# EAGLE design CAN (EAGLE 9.5.1)
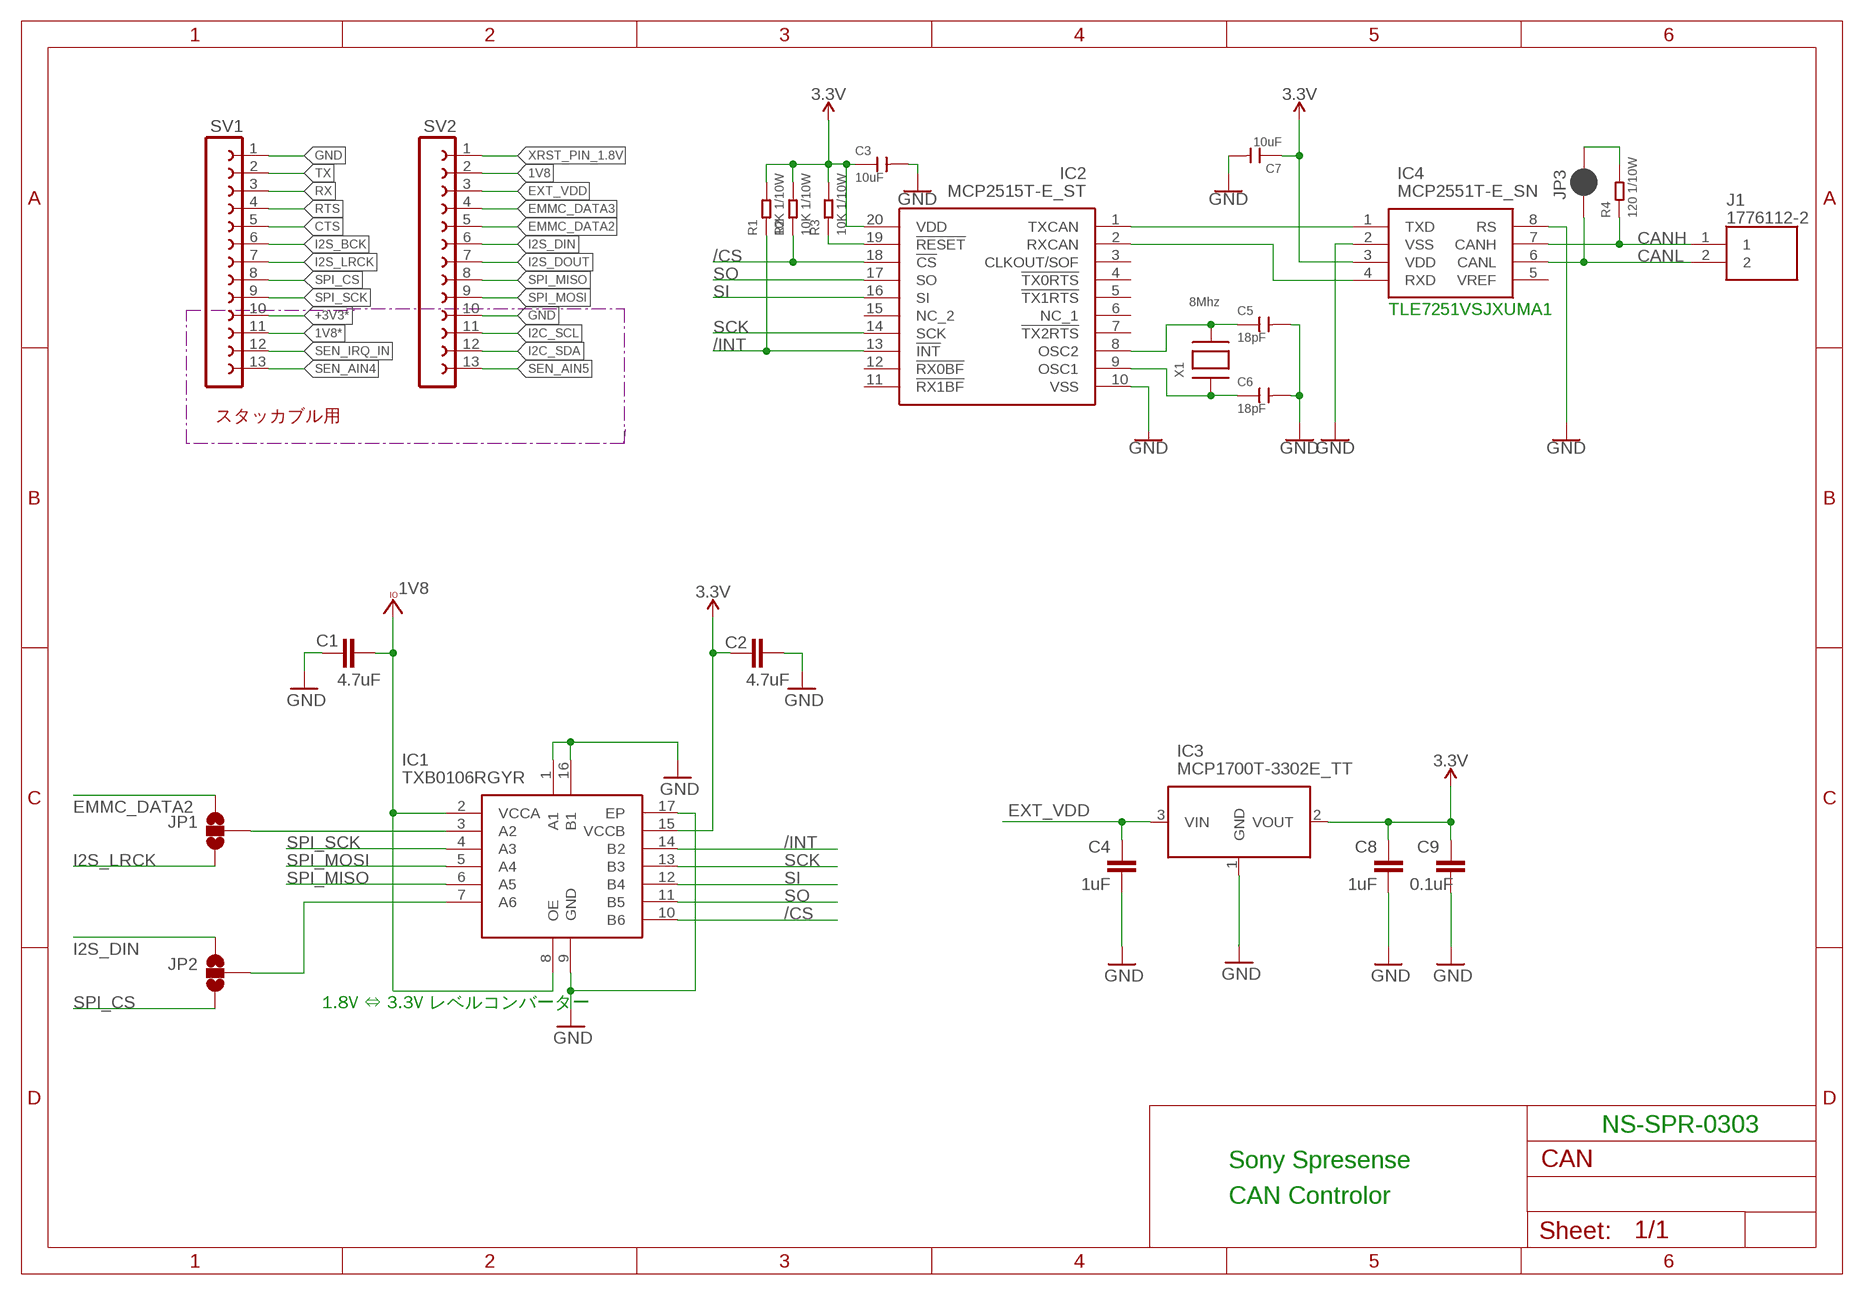
[diagram p0: schematic, sheet 1]

## Parts
C1  4.7uF  C-EUC0603K  [C0603K]
C2  4.7uF  C-EUC0603K  [C0603K]
C3  10uF  CERAMIC-27PF-50V-5%-NPO(0603)  [C0603]
C4  1uF  C-EUC0603K  [C0603K]
C5  18pF  CERAMIC-27PF-50V-5%-NPO(0603)  [C0603]
C6  18pF  CERAMIC-27PF-50V-5%-NPO(0603)  [C0603]
C7  10uF  CERAMIC-27PF-50V-5%-NPO(0603)  [C0603]
C8  1uF  C-EUC0603K  [C0603K]
C9  0.1uF  C-EUC0603K  [C0603K]
IC1  TXB0106RGYR  [SN74CBT3257CRGYR]
IC2  MCP2515T-E_ST  [SOP65P640X120-20N]
IC3  MCP1700T-3302E_TT  [SOT95P237X112-3N]
IC4  MCP2551T-E_SN  [SOIC127P600X175-8N]
J1  1776112-2  [SHDR2W90P0X348_1X2_700X730X850]
JP1  JUMPER-SMT_3_NO_NO-SILK  [SMT-JUMPER_3_NO_NO-SILK]
JP2  JUMPER-SMT_3_NO_NO-SILK  [SMT-JUMPER_3_NO_NO-SILK]
JP3  JUMPER-SMT_2_NC_PASTE_NO-SILK  [SMT-JUMPER_2_NC_PASTE_NO-SILK]
R1  10K 1/10W  SMD-RES-10K-5%-1/10W(0603)  [R0603]
R2  10K 1/10W  SMD-RES-10K-5%-1/10W(0603)  [R0603]
R3  10K 1/10W  SMD-RES-10K-5%-1/10W(0603)  [R0603]
R4  120 1/10W  SMD-RES-10K-5%-1/10W(0603)  [R0603]
SV1  FE13-1  [FE13]
SV2  FE13-1  [FE13]
X1  8Mhz  306010040_XTAL_12MHZ_HC49UP  [HC49UP]

## Nets
1V8: C1.2 IC1.2(VCCA) IC1.8(OE) SV2.2
1V8*: SV1.11
3.3V: C2.1 C3.1 C7.1 C8.1 C9.1 IC1.15(VCCB) IC2.20(VDD) IC3.2(VOUT) IC4.3(VDD) R1.2 R2.2 R3.2
+3V3*: SV1.10
/CS: IC1.10(B6) IC2.18(!CS) R2.1
/INT: IC1.14(B2) IC2.13(!INT) R1.1
CANH: IC4.7(CANH) J1.1 R4.1
CANL: IC4.6(CANL) J1.2 JP3.1
CTS: SV1.5
EMMC_DATA2: JP1.1 SV2.5
EMMC_DATA3: SV2.4
EXT_VDD: C4.1 IC3.3(VIN) SV2.3
GND: C1.1 C2.2 C3.2 C4.2 C5.2 C6.2 C7.2 C8.2 C9.2 IC1.1(A1) IC1.9(GND) IC1.16(B1) IC1.17(EP) IC2.10(VSS) IC3.1(GND) IC4.2(VSS) IC4.8(RS) SV1.1 SV2.10
I2C_SCL: SV2.11
I2C_SDA: SV2.12
I2S_BCK: SV1.6
I2S_DIN: JP2.1 SV2.6
I2S_DOUT: SV2.7
I2S_LRCK: JP1.3 SV1.7
N$1: IC2.1(TXCAN) IC4.1(TXD)
N$2: IC2.2(RXCAN) IC4.4(RXD)
N$3: IC1.7(A6) JP2.2
N$4: IC1.3(A2) JP1.2
N$5: C5.1 IC2.8(OSC2) X1.P$2
N$8: C6.1 IC2.9(OSC1) X1.P$1
N$9: JP3.2 R4.2
N$14: IC2.19(!RESET) R3.1
RTS: SV1.4
RX: SV1.3
SCK: IC1.13(B3) IC2.14(SCK)
SEN_AIN4: SV1.13
SEN_AIN5: SV2.13
SEN_IRQ_IN: SV1.12
SI: IC1.12(B4) IC2.16(SI)
SO: IC1.11(B5) IC2.17(SO)
SPI_CS: JP2.3 SV1.8
SPI_MISO: IC1.6(A5) SV2.8
SPI_MOSI: IC1.5(A4) SV2.9
SPI_SCK: IC1.4(A3) SV1.9
TX: SV1.2
XRST_PIN_1.8V: SV2.1
Unconnected: IC2.3(CLKOUT/SOF) IC2.4(!TX0RTS) IC2.5(!TX1RTS) IC2.6(NC_1) IC2.7(!TX2RTS) IC2.11(!RX1BF) IC2.12(!RX0BF) IC2.15(NC_2) IC4.5(VREF)

## Notes on the sheet
- TLE7251VSJXUMA1
- スタッカブル用
- 1.8V ⇔ 3.3V レベルコンバーター
- NS-SPR-0303
- Sony Spresense
- CAN Controlor

## Library data of the parts
C1 C2 C4 C8 C9 = rcl:C-EU: CAPACITOR, European symbol; SPICEPREFIX: C
C3 C5-C7 = Seeed-Capacitor:CERAMIC-27PF-50V-5%-NPO(0603): 302010142; MPN: CC0603JRNPO9BN270; VALUE: 27pf
IC1 = SamacSys_Parts:TXB0106RGYR: Translation - Voltage Levels 8B Bidirec Vltg-Lev Translator Source: Datasheet <https://www.ti.com/lit/gpn/TXB0106>; DESCRIPTION: Translation - Voltage Levels 8B Bidirec Vltg-Lev Translator; HEIGHT: mm; MANUFACTURER_NAME: Texas Instruments; MANUFACTURER_PART_NUMBER: TXB0106RGYR; MOUSER_PART_NUMBER: 595-TXB0106RGYR; MOUSER_PRICE-STOCK: https://www.mouser.co.uk/ProductDetail/Texas-Instruments/TXB0106RGYR?qs=XGzIaZb%2FFYLhB9Sk%252BZUXMA%3D%3D
IC2 = SamacSys_Parts:MCP2515T-E_ST: CAN Interface IC W/ SPI Inter 125dC Source: Datasheet <https://componentsearchengine.com/Datasheets/1/MCP2515T-E_ST.pdf>; DESCRIPTION: CAN Interface IC W/ SPI Inter 125dC; HEIGHT: 1.2mm; MANUFACTURER_NAME: Microchip; MANUFACTURER_PART_NUMBER: MCP2515T-E/ST; MOUSER_PART_NUMBER: 579-MCP2515T-E/ST; MOUSER_PRICE-STOCK: https://www.mouser.co.uk/ProductDetail/Microchip-Technology/MCP2515T-E-ST?qs=gZwDaUDMhIfK2YaexRiDHw%3D%3D
IC3 = SamacSys_Parts:MCP1700T-3302E_TT: LDO voltage regulator 250mA Isupply 1uA Source: Datasheet <https://componentsearchengine.com/Datasheets/1/MCP1700T-3302E_TT.pdf>; DESCRIPTION: LDO voltage regulator 250mA Isupply 1uA; HEIGHT: 1.12mm; MANUFACTURER_NAME: Microchip; MANUFACTURER_PART_NUMBER: MCP1700T-3302E/TT; MOUSER_PART_NUMBER: 579-MCP1700T3302E/TT; MOUSER_PRICE-STOCK: https://www.mouser.com/Search/Refine.aspx?Keyword=579-MCP1700T3302E%2FTT
IC4 = SamacSys_Parts:MCP2551T-E_SN: CAN Interface IC Hi Spd CAN Transceiv Source: Datasheet <https://componentsearchengine.com/Datasheets/1/MCP2551T-E_SN.pdf>; DESCRIPTION: CAN Interface IC Hi Spd CAN Transceiv; HEIGHT: 1.75mm; MANUFACTURER_NAME: Microchip; MANUFACTURER_PART_NUMBER: MCP2551T-E/SN; MOUSER_PART_NUMBER: 579-MCP2551T-E/SN; MOUSER_PRICE-STOCK: https://www.mouser.co.uk/ProductDetail/Microchip-Technology/MCP2551T-E-SN?qs=gZwDaUDMhIcQtLtB%252B7bOWQ%3D%3D
J1 = SamacSys_Parts:1776112-2: Conn Eurostyle Block 2 POS 3.5mm Solder ST Thru-Hole 12A/Contact Source: Datasheet <https://www.te.com/commerce/DocumentDelivery/DDEController?Action=showdoc&DocId=Customer Drawing1776112P1pdfEnglishENG_CD_1776112_P1.pdf1776112-2>; DESCRIPTION: Conn Eurostyle Block 2 POS 3.5mm Solder ST Thru-Hole 12A/Contact; HEIGHT: 8.5mm; MANUFACTURER_NAME: TE Connectivity; MANUFACTURER_PART_NUMBER: 1776112-2; MOUSER_PART_NUMBER: 571-1776112-2; MOUSER_PRICE-STOCK: https://www.mouser.co.uk/ProductDetail/TE-Connectivity/1776112-2?qs=wXhBCuSapIMFZRJKCceP3Q%3D%3D
JP1 JP2 = SparkFun-Jumpers:JUMPER-SMT_3_NO: Normally open jumper This jumper has three pads in close proximity to each other. Apply solder to close the connection(s).
JP3 = SparkFun-Jumpers:JUMPER-SMT_2_NC_PASTE: Normally closed solder jumper This jumper has an aperture in the stencil to allow solder paste to bridge the split in the wire so it's normally closed (NC). Wick off the solder to open the connection. Reapply solder to reclose the connection.
R1-R3 = OPL_Resistor:SMD-RES-10K-5%-1/10W(0603): 301010293; MPN: RC0603JR-0710KL
R4 = OPL_Resistor:SMD-RES-10K-5%-1/10W(0603): 301010293; MPN: RC0603JR-0710KL; VALUE: 10K 1/10W
SV1 SV2 = con-lsta:FE13-1: FEMALE HEADER; OC_FARNELL: unknown; OC_NEWARK: unknown
X1 = Seeed-OPL-2017-01-Crystal-Akita:306010040_XTAL_12MHZ_HC49UP: SMD Crystal 12Mhz-20pF-20ppm-40R;HC49UP, SKU: 306010040

## Board
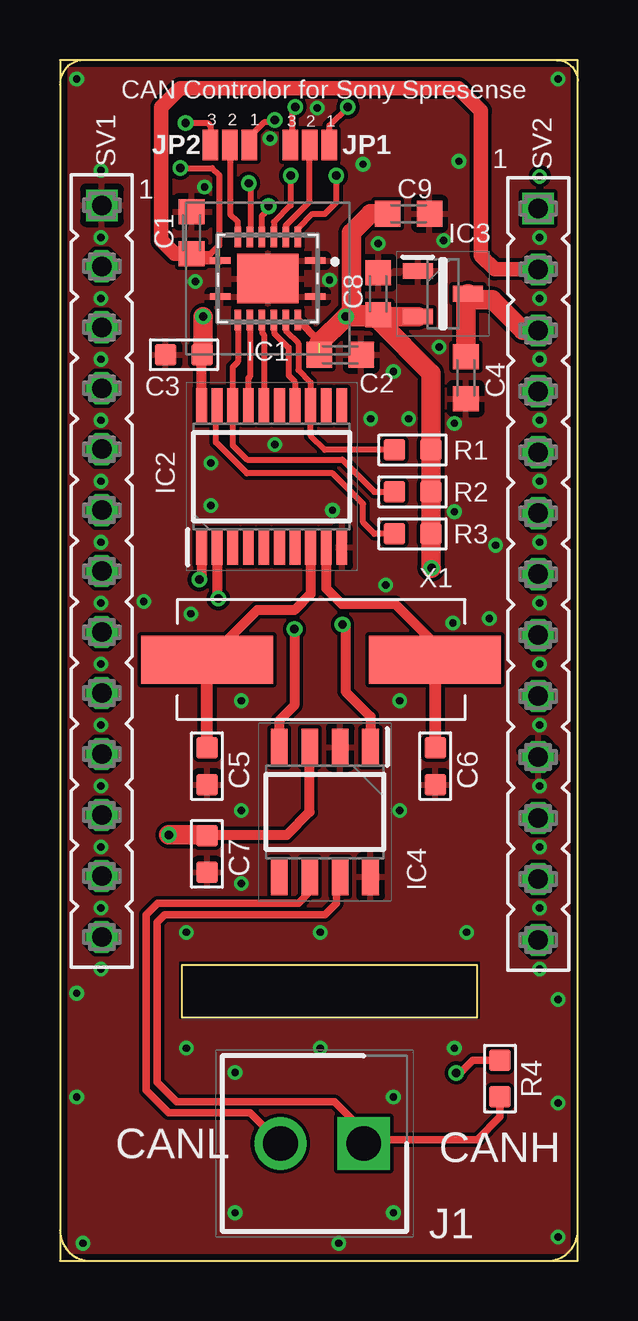
[diagram p1: board, top side]
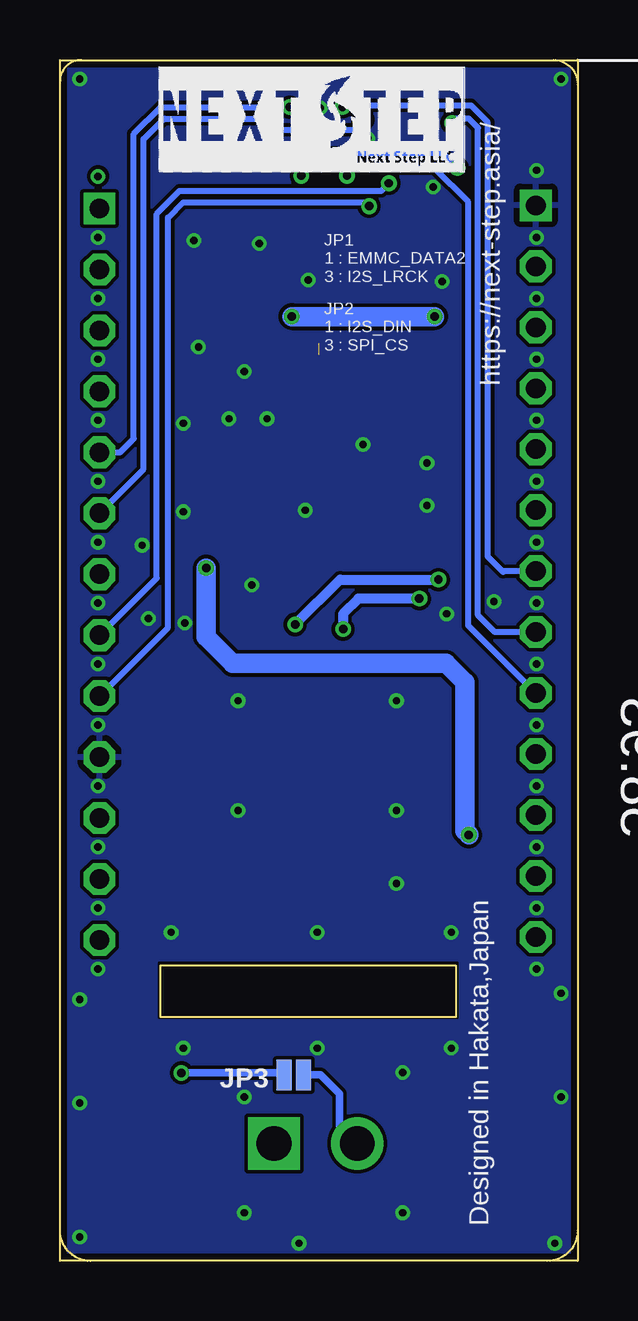
[diagram p2: board, bottom side, seen from below]

Size 21.59 x 50.04 mm. Coordinates in mm from the lower left corner, seen from the top.
Outline: 0,0 21.59,0 21.59,50.04 0,50.04 0,0
Copper layers (1*16): Top 0.035mm / dielectric 1.5mm / Bottom 0.035mm
Design rules "SeeedStudio_2layer_DRU_no_angle_20140221": minimum track width 6mil, minimum drill 12mil, track to track 6mil, track to pad 6mil, pad to pad 6mil, via to via 6mil, smd to smd 0mil, copper to edge 10mil, drill to drill 10mil, minimum pad ring 10mil, minimum via ring 6mil, stop-mask expansion 2mil, vias tented up to drill 100mil, thermal gap 10mil
tRestrict: 4 lines
bRestrict: 4 lines
Milling: 9 lines

### Footprints (pad centres in the part's own frame; a part is rotated, then mirrored left to right if it is on the bottom)
C0603K = smd 1.05 x 1.08: 1 -0.875,0; 2 0.875,0
C0603 = smd 0.889 x 0.889: 1 0,0.762; 2 0,-0.762
SN74CBT3257CRGYR = smd 0.85 x 0.28: 1 -1.975,-0.75; 8 1.975,-0.75; 9 1.975,0.75; 16 -1.975,0.75 | smd 0.28 x 0.85: 2 -1.25,-1.725; 3 -0.75,-1.725; 4 -0.25,-1.725; 5 0.25,-1.725; 6 0.75,-1.725; 7 1.25,-1.725; 10 1.25,1.725; 11 0.75,1.725; 12 0.25,1.725; 13 -0.25,1.725; 14 -0.75,1.725; 15 -1.25,1.725 | smd 2.55 x 2.05: 17 0,0
SOP65P640X120-20N = smd 1.475 x 0.45: 1 -2.938,2.925; 2 -2.938,2.275; 3 -2.938,1.625; 4 -2.938,0.975; 5 -2.938,0.325; 6 -2.938,-0.325; 7 -2.938,-0.975; 8 -2.938,-1.625; 9 -2.938,-2.275; 10 -2.938,-2.925; 11 2.938,-2.925; 12 2.938,-2.275; 13 2.938,-1.625; 14 2.938,-0.975; 15 2.938,-0.325; 16 2.938,0.325; 17 2.938,0.975; 18 2.938,1.625; 19 2.938,2.275; 20 2.938,2.925
SOT95P237X112-3N = smd 1.25 x 0.65: 1 -1.05,0.95; 2 -1.05,-0.95; 3 1.05,0
SOIC127P600X175-8N = smd 1.55 x 0.7: 1 -2.7,1.905; 2 -2.7,0.635; 3 -2.7,-0.635; 4 -2.7,-1.905; 5 2.7,-1.905; 6 2.7,-0.635; 7 2.7,0.635; 8 2.7,1.905
SHDR2W90P0X348_1X2_700X730X850 = drill 1.45 pad 2.175 square: 1 0,0 | drill 1.45 pad 2.175: 2 3.475,0
SMT-JUMPER_3_NO_NO-SILK = smd 0.635 x 1.27: 1 -0.813,0; 2 0,0; 3 0.813,0
SMT-JUMPER_2_NC_PASTE_NO-SILK = smd 0.635 x 1.27: 1 -0.406,0; 2 0.406,0
R0603 = smd 0.889 x 0.889: 1 0,0.762; 2 0,-0.762
FE13 = drill 0.813 square: 1 -15.24,0 | drill 0.813 octagon: 2 -12.7,0; 3 -10.16,0; 4 -7.62,0; 5 -5.08,0; 6 -2.54,0; 7 0,0; 8 2.54,0; 9 5.08,0; 10 7.62,0; 11 10.16,0; 12 12.7,0; 13 15.24,0
HC49UP = smd 5.5 x 2: P$1 -4.75,0; P$2 4.75,0

### Placement (x,y rotation side)
C1  5.49,42.84 270 top
C2  11.68,37.76 0 top
C3  5.18,37.76 270 top
C4  16.92,36.8 270 top
C5  6.13,20.61 0 top
C6  15.65,20.61 0 top
C7  6.13,16.96 0 top
C8  13.27,40.3 90 top
C9  14.54,43.63 0 top
IC1  8.67,40.93 180 top
IC2  8.83,32.68 90 top
IC3  15.97,40.3 0 top
IC4  11.05,18.71 270 top
J1  12.67,4.9 180 top
JP1  10.41,46.49 180 top
JP2  7.08,46.49 180 top
JP3  11.84,7.75 180 bottom
R1  14.7,33.79 90 top
R2  14.7,32.04 90 top
R3  14.7,30.3 90 top
R4  18.35,7.59 180 top
SV1  1.75,28.74 270 top
SV2  19.94,28.61 270 top
X1  10.89,25.06 180 top

### Tracks (layer width: path | path; a pad name or v marks a point on that pad's centre or on a via)
1V8  (via drill 0.35)
  Top 0.254: C1.2 5.65,41.96 6.29,41.96 6.64,42.31 6.64,45.25 6.35,45.54 v5.02,45.54 | IC1.2 9.92,43.01 10.54,43.63 11.05,43.63 11.53,44.11 v11.53,45.22
  Top 0.305: IC1.8 5.77,41.68 C1.2
  Top 0.61: SV2.2 18.13,41.31 17.56,41.88 17.56,47.92 16.61,48.87 5.02,48.87 4.22,48.08 4.22,42.52 4.78,41.96 5.65,41.96
  Bottom 0.254: v11.53,45.22 11.53,45.69 11.05,46.17 5.65,46.17 v5.02,45.54
3.3V  (via drill 0.35)  (1 unrouted)
  Top 0.305: IC1.15 10.81,38.32 C2.1
  Top 0.406: IC2.20 5.9,37.72 C3.1 | C7.1 6.16,17.75 9.46,17.75 10.41,18.71 IC4.3
  Top 0.813: IC3.2 13.35,39.35 | 13.35,39.35 C8.1 | C8.1 12.4,39.42 12.16,39.66 | 12.16,39.66 12.16,42.84 12.95,43.63 C9.1 | v11.92,39.35 10.81,38.23 | v11.92,39.35 13.35,39.35 | C8.1 13.27,39.19 15.46,36.99 R1.2 R2.2 R3.2 15.46,28.9 v15.49,28.87 | v4.54,17.75 6.1,17.75 C7.1 | 12.16,39.66 12.16,39.58 v11.92,39.35 | v5.97,39.34 5.97,37.79 5.9,37.72
  Bottom 0.813: v15.49,28.87 15.49,26.01 14.38,24.9 5.49,24.9 4.7,24.1 4.7,17.91 v4.54,17.75 | v11.92,39.35 v5.97,39.35 v5.97,39.34
/CS
  Top 0.254: IC1.10 7.42,37.46 7.2,37.24 IC2.18 7.21,33.98 7.8,33.38 11.77,33.38 13.11,32.04 R2.1
/INT
  Top 0.254: IC1.14 9.43,39.19 9.43,38.73 9.94,38.23 9.94,37.12 10.45,36.61 IC2.13 10.45,34.39 11.05,33.79 R1.1
CANH
  Top 0.305: IC4.7 11.53,15.85 11.53,14.9 11.05,14.42 4.36,14.42 4.04,14.1 4.04,7.44 4.86,6.62 11.45,6.62 12.67,5.4 J1.1 12.83,5.05 17.4,5.05 18.35,6.01 R4.1
CANL
  Top 0.305: IC4.6 10.41,15.37 9.94,14.9 4.06,14.9 3.59,14.42 3.59,7.12 4.54,6.17 7.92,6.17 J1.2
  Bottom 0.305: JP3.1 10.73,7.75 9.94,6.96 9.94,5.64 J1.2
EMMC_DATA2  (via drill 0.35)
  Top 0.254: v12,48.08 11.23,47.3 JP1.1
  Bottom 0.254: SV2.5 19.08,33.69 18.51,34.26 18.51,46.96 17.4,48.08 v12,48.08
EXT_VDD
  Top 0.813: SV2.3 19.3,38.77 18.03,40.04 17.27,40.04 IC3.3 16.92,40.2 C4.1
GND  (via drill 0.3)
  other vias: 8.76,46.77 12.64,45.69 16.64,45.82 16,42.52 13.27,42.39 11.24,40.87 5.65,40.81 10.73,48.04 15.81,38.07 13.91,37.06 16.45,34.9 14.54,35.09 12.95,35.09 16.45,31.22 11.37,31.28 8.95,34.01 6.29,33.25 6.29,31.47 13.59,28.17 5.46,26.96 16.38,26.58 18.16,29.82 17.91,26.77 6.03,44.74 16.45,8.86 10.86,8.86 5.27,8.86 5.27,13.69 10.86,13.69 16.95,13.69 13.91,6.83 7.3,7.85 7.3,2.01 13.91,2.01 0.7,11.15 0.7,6.83 0.95,0.74 11.62,0.74 20.76,0.99 20.76,6.58 20.76,10.9 7.56,15.72 7.56,18.77 7.56,23.34 14.16,18.77 14.16,23.34 1.71,12.17 1.71,14.71 1.71,17.25 1.71,19.79 1.71,22.33 1.71,24.87 1.71,27.41 3.49,27.47 1.71,29.95 1.71,32.49 1.71,35.03 1.71,37.57 1.71,40.11 1.71,42.65 1.71,45.44 0.7,49.25 20.76,49.25 20,42.65 20,40.11 20,37.57 20,35.03 20,32.49 20,29.95 20,27.41 20,24.87 20,22.33 20,19.79 20,17.25 20,14.71 20,12.17
  pour Top: 0.06,50.01 21.65,50.01 21.65,0.04 0.06,0.04
  pour Bottom: 0.06,50.01 21.65,50.01 21.65,48.55 21.65,0.04 0.06,0.04 0.06,0.74
I2S_DIN  (via drill 0.35)
  Top 0.254: v8.96,47.54 8.86,47.44 8.51,47.44 7.89,46.82 JP2.1
  Bottom 0.254: SV2.6 18.1,32.99 18.1,46.74 17.24,47.6 13.11,47.6 12.64,47.12 9.3,47.12 8.96,47.47 v8.96,47.54
I2S_LRCK  (via drill 0.35)
  Top 0.254: v9.81,48.08 9.68,47.96 9.68,46.57 JP1.3
  Bottom 0.254: SV1.7 3.08,28.74 3.11,28.71 3.75,29.34 3.75,47.44 4.45,48.15 9.75,48.15 v9.81,48.08
N$1  (via drill 0.35)
  Top 0.406: IC2.1 5.9,28.48 v5.81,28.39 | v11.78,26.52 11.91,26.39 11.91,23.72 12.95,22.68 IC4.1
  Bottom 0.406: v5.81,28.39 9.91,28.39 v11.78,26.52
N$2  (via drill 0.35)
  Top 0.406: IC2.2 6.55,27.65 v6.6,27.6 | IC4.4 9.14,22.52 9.78,23.15 v9.78,26.33
  Bottom 0.406: v6.6,27.6 9.14,27.6 9.78,26.96 v9.78,26.33
N$3
  Top 0.254: IC1.7 7.42,43.29 7.1,43.61 7.1,46.47 JP2.2
N$4
  Top 0.254: IC1.3 9.42,43.14 10.41,44.14 JP1.2
N$5
  Top 0.406: IC2.8 10.45,27.79 9.78,27.12 8.22,27.12 6.13,25.03 6.13,24.74
  Top 0.508: C5.1 6.13,24.74 X1.P$2
N$8
  Top 0.406: IC2.9 11.1,28.02 11.75,27.37 13.97,27.37 15.65,25.69 15.65,25.04
  Top 0.508: C6.1 15.65,25.04 X1.P$1
N$9  (via drill 0.35)
  Top 0.305: R4.2 17.21,8.36 16.61,7.75 v16.53,7.83
  Bottom 0.305: v16.53,7.83 12.33,7.83 JP3.2
N$14
  Top 0.254: R3.1 13.11,30.3 12.64,30.77 12.64,31.55 11.37,32.82 7.79,32.82 6.51,34.1 6.51,35.57 IC2.19
N$25  (via drill 0.3)
  other vias: 20,45.19
SCK
  Top 0.254: IC1.13 8.93,39.19 8.93,38.66 9.53,38.06 9.53,36.89 9.8,36.62 IC2.14
SI
  Top 0.254: IC1.12 8.43,39.19 8.43,38.67 8.5,38.6 IC2.16
SO
  Top 0.254: IC1.11 7.92,36.85 7.85,36.78 IC2.17
SPI_CS  (via drill 0.35)
  Top 0.254: v5.24,47.41 6.15,47.41 6.29,47.28 6.29,46.51 JP2.3
  Bottom 0.254: SV1.8 3.46,26.2 4.15,26.89 4.15,47.21 4.54,47.6 5.05,47.6 v5.24,47.41
SPI_MISO  (via drill 0.35)
  Top 0.254: IC1.6 7.94,42.68 7.94,44.84 v7.87,44.9
  Bottom 0.254: SV2.8 17.56,28.45 17.56,43.63 16.61,44.58 8.19,44.58 v7.87,44.9
SPI_MOSI  (via drill 0.35)
  Top 0.254: v8.7,43.95 8.7,43.82 8.41,43.54 IC1.5
  Bottom 0.254: SV2.9 17.08,26.39 17.08,43.47 16.45,44.11 8.73,44.11 8.7,44.08 v8.7,43.95
SPI_SCK  (via drill 0.35)
  Top 0.254: IC1.4 8.92,43.28 9.62,43.98 v9.62,45.22
  Bottom 0.254: SV1.9 4.56,26.47 4.56,44.13 5.97,45.54 9.3,45.54 v9.62,45.22

### Text on the board
tPlace: CAN Controlor for Sony Spresense | 3 | 2 | 1 | 3 | 2 | 1 | 1 | 1 | 1 | CANL | CANH
bPlace: https://next-step.asia/ | JP1 / 1 : EMMC_DATA2 / 3 : I2S_LRCK | JP2 / 1 : I2S_DIN / 3 : SPI_CS | Designed in Hakata,Japan | V0.01 | NS-SPR-0302